# Altium project Ultrascale.PrjPcb (part 2 of 3)

## Sheet Sheet10.SchDoc
size A3
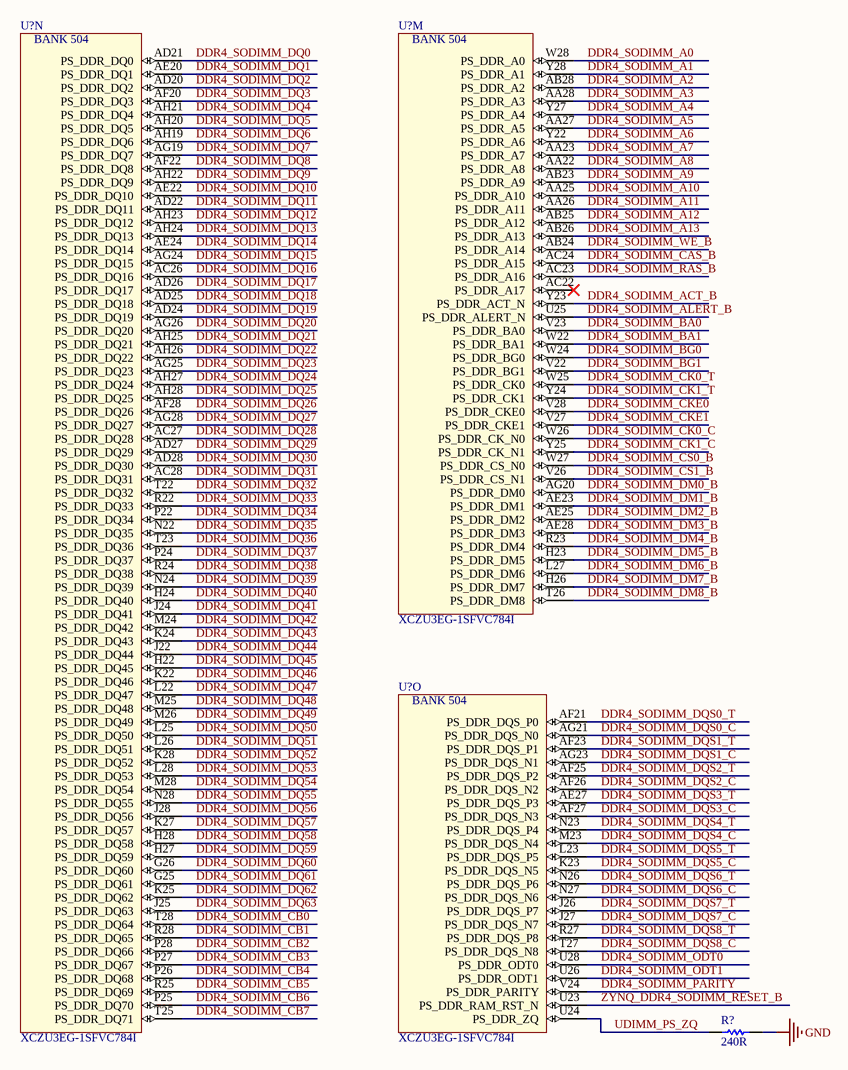
[diagram p5: Sheet10.SchDoc]

### Parts
(Parts that share a designator on the sheet are numbered #1, #2 ... from top to bottom, then left to right.)
R?#37  value 240R  [RESC1005L_0402]  (hidden comment: RES0402_240R_0W1_1T)
U?#29  XCZU3EG-1SFVC784I  [BGA784x28]  (part N of 22)
U?#30  XCZU3EG-1SFVC784I  [BGA784x28]  (part M of 22)
U?#31  XCZU3EG-1SFVC784I  [BGA784x28]  (part O of 22)

### Nets
GND: R?#37.1
DDR4_SODIMM_A0: U?#30.W28(PS_DDR_A0)
DDR4_SODIMM_A1: U?#30.Y28(PS_DDR_A1)
DDR4_SODIMM_A2: U?#30.AB28(PS_DDR_A2)
DDR4_SODIMM_A3: U?#30.AA28(PS_DDR_A3)
DDR4_SODIMM_A4: U?#30.Y27(PS_DDR_A4)
DDR4_SODIMM_A5: U?#30.AA27(PS_DDR_A5)
DDR4_SODIMM_A6: U?#30.Y22(PS_DDR_A6)
DDR4_SODIMM_A7: U?#30.AA23(PS_DDR_A7)
DDR4_SODIMM_A8: U?#30.AA22(PS_DDR_A8)
DDR4_SODIMM_A9: U?#30.AB23(PS_DDR_A9)
DDR4_SODIMM_A10: U?#30.AA25(PS_DDR_A10)
DDR4_SODIMM_A11: U?#30.AA26(PS_DDR_A11)
DDR4_SODIMM_A12: U?#30.AB25(PS_DDR_A12)
DDR4_SODIMM_A13: U?#30.AB26(PS_DDR_A13)
DDR4_SODIMM_ACT_B: U?#30.Y23(PS_DDR_ACT_N)
DDR4_SODIMM_ALERT_B: U?#30.U25(PS_DDR_ALERT_N)
DDR4_SODIMM_BA0: U?#30.V23(PS_DDR_BA0)
DDR4_SODIMM_BA1: U?#30.W22(PS_DDR_BA1)
DDR4_SODIMM_BG0: U?#30.W24(PS_DDR_BG0)
DDR4_SODIMM_BG1: U?#30.V22(PS_DDR_BG1)
DDR4_SODIMM_CAS_B: U?#30.AC24(PS_DDR_A15)
DDR4_SODIMM_CB0: U?#29.T28(PS_DDR_DQ64)
DDR4_SODIMM_CB1: U?#29.R28(PS_DDR_DQ65)
DDR4_SODIMM_CB2: U?#29.P28(PS_DDR_DQ66)
DDR4_SODIMM_CB3: U?#29.P27(PS_DDR_DQ67)
DDR4_SODIMM_CB4: U?#29.P26(PS_DDR_DQ68)
DDR4_SODIMM_CB5: U?#29.R25(PS_DDR_DQ69)
DDR4_SODIMM_CB6: U?#29.P25(PS_DDR_DQ70)
DDR4_SODIMM_CB7: U?#29.T25(PS_DDR_DQ71)
DDR4_SODIMM_CK0_C: U?#30.W26(PS_DDR_CK_N0)
DDR4_SODIMM_CK0_T: U?#30.W25(PS_DDR_CK0)
DDR4_SODIMM_CK1_C: U?#30.Y25(PS_DDR_CK_N1)
DDR4_SODIMM_CK1_T: U?#30.Y24(PS_DDR_CK1)
DDR4_SODIMM_CKE0: U?#30.V28(PS_DDR_CKE0)
DDR4_SODIMM_CKE1: U?#30.V27(PS_DDR_CKE1)
DDR4_SODIMM_CS0_B: U?#30.W27(PS_DDR_CS_N0)
DDR4_SODIMM_CS1_B: U?#30.V26(PS_DDR_CS_N1)
DDR4_SODIMM_DM0_B: U?#30.AG20(PS_DDR_DM0)
DDR4_SODIMM_DM1_B: U?#30.AE23(PS_DDR_DM1)
DDR4_SODIMM_DM2_B: U?#30.AE25(PS_DDR_DM2)
DDR4_SODIMM_DM3_B: U?#30.AE28(PS_DDR_DM3)
DDR4_SODIMM_DM4_B: U?#30.R23(PS_DDR_DM4)
DDR4_SODIMM_DM5_B: U?#30.H23(PS_DDR_DM5)
DDR4_SODIMM_DM6_B: U?#30.L27(PS_DDR_DM6)
DDR4_SODIMM_DM7_B: U?#30.H26(PS_DDR_DM7)
DDR4_SODIMM_DM8_B: U?#30.T26(PS_DDR_DM8)
DDR4_SODIMM_DQ0: U?#29.AD21(PS_DDR_DQ0)
DDR4_SODIMM_DQ1: U?#29.AE20(PS_DDR_DQ1)
DDR4_SODIMM_DQ2: U?#29.AD20(PS_DDR_DQ2)
DDR4_SODIMM_DQ3: U?#29.AF20(PS_DDR_DQ3)
DDR4_SODIMM_DQ4: U?#29.AH21(PS_DDR_DQ4)
DDR4_SODIMM_DQ5: U?#29.AH20(PS_DDR_DQ5)
DDR4_SODIMM_DQ6: U?#29.AH19(PS_DDR_DQ6)
DDR4_SODIMM_DQ7: U?#29.AG19(PS_DDR_DQ7)
DDR4_SODIMM_DQ8: U?#29.AF22(PS_DDR_DQ8)
DDR4_SODIMM_DQ9: U?#29.AH22(PS_DDR_DQ9)
DDR4_SODIMM_DQ10: U?#29.AE22(PS_DDR_DQ10)
DDR4_SODIMM_DQ11: U?#29.AD22(PS_DDR_DQ11)
DDR4_SODIMM_DQ12: U?#29.AH23(PS_DDR_DQ12)
DDR4_SODIMM_DQ13: U?#29.AH24(PS_DDR_DQ13)
DDR4_SODIMM_DQ14: U?#29.AE24(PS_DDR_DQ14)
DDR4_SODIMM_DQ15: U?#29.AG24(PS_DDR_DQ15)
DDR4_SODIMM_DQ16: U?#29.AC26(PS_DDR_DQ16)
DDR4_SODIMM_DQ17: U?#29.AD26(PS_DDR_DQ17)
DDR4_SODIMM_DQ18: U?#29.AD25(PS_DDR_DQ18)
DDR4_SODIMM_DQ19: U?#29.AD24(PS_DDR_DQ19)
DDR4_SODIMM_DQ20: U?#29.AG26(PS_DDR_DQ20)
DDR4_SODIMM_DQ21: U?#29.AH25(PS_DDR_DQ21)
DDR4_SODIMM_DQ22: U?#29.AH26(PS_DDR_DQ22)
DDR4_SODIMM_DQ23: U?#29.AG25(PS_DDR_DQ23)
DDR4_SODIMM_DQ24: U?#29.AH27(PS_DDR_DQ24)
DDR4_SODIMM_DQ25: U?#29.AH28(PS_DDR_DQ25)
DDR4_SODIMM_DQ26: U?#29.AF28(PS_DDR_DQ26)
DDR4_SODIMM_DQ27: U?#29.AG28(PS_DDR_DQ27)
DDR4_SODIMM_DQ28: U?#29.AC27(PS_DDR_DQ28)
DDR4_SODIMM_DQ29: U?#29.AD27(PS_DDR_DQ29)
DDR4_SODIMM_DQ30: U?#29.AD28(PS_DDR_DQ30)
DDR4_SODIMM_DQ31: U?#29.AC28(PS_DDR_DQ31)
DDR4_SODIMM_DQ32: U?#29.T22(PS_DDR_DQ32)
DDR4_SODIMM_DQ33: U?#29.R22(PS_DDR_DQ33)
DDR4_SODIMM_DQ34: U?#29.P22(PS_DDR_DQ34)
DDR4_SODIMM_DQ35: U?#29.N22(PS_DDR_DQ35)
DDR4_SODIMM_DQ36: U?#29.T23(PS_DDR_DQ36)
DDR4_SODIMM_DQ37: U?#29.P24(PS_DDR_DQ37)
DDR4_SODIMM_DQ38: U?#29.R24(PS_DDR_DQ38)
DDR4_SODIMM_DQ39: U?#29.N24(PS_DDR_DQ39)
DDR4_SODIMM_DQ40: U?#29.H24(PS_DDR_DQ40)
DDR4_SODIMM_DQ41: U?#29.J24(PS_DDR_DQ41)
DDR4_SODIMM_DQ42: U?#29.M24(PS_DDR_DQ42)
DDR4_SODIMM_DQ43: U?#29.K24(PS_DDR_DQ43)
DDR4_SODIMM_DQ44: U?#29.J22(PS_DDR_DQ44)
DDR4_SODIMM_DQ45: U?#29.H22(PS_DDR_DQ45)
DDR4_SODIMM_DQ46: U?#29.K22(PS_DDR_DQ46)
DDR4_SODIMM_DQ47: U?#29.L22(PS_DDR_DQ47)
DDR4_SODIMM_DQ48: U?#29.M25(PS_DDR_DQ48)
DDR4_SODIMM_DQ49: U?#29.M26(PS_DDR_DQ49)
DDR4_SODIMM_DQ50: U?#29.L25(PS_DDR_DQ50)
DDR4_SODIMM_DQ51: U?#29.L26(PS_DDR_DQ51)
DDR4_SODIMM_DQ52: U?#29.K28(PS_DDR_DQ52)
DDR4_SODIMM_DQ53: U?#29.L28(PS_DDR_DQ53)
DDR4_SODIMM_DQ54: U?#29.M28(PS_DDR_DQ54)
DDR4_SODIMM_DQ55: U?#29.N28(PS_DDR_DQ55)
DDR4_SODIMM_DQ56: U?#29.J28(PS_DDR_DQ56)
DDR4_SODIMM_DQ57: U?#29.K27(PS_DDR_DQ57)
DDR4_SODIMM_DQ58: U?#29.H28(PS_DDR_DQ58)
DDR4_SODIMM_DQ59: U?#29.H27(PS_DDR_DQ59)
DDR4_SODIMM_DQ60: U?#29.G26(PS_DDR_DQ60)
DDR4_SODIMM_DQ61: U?#29.G25(PS_DDR_DQ61)
DDR4_SODIMM_DQ62: U?#29.K25(PS_DDR_DQ62)
DDR4_SODIMM_DQ63: U?#29.J25(PS_DDR_DQ63)
DDR4_SODIMM_DQS0_C: U?#31.AG21(PS_DDR_DQS_N0)
DDR4_SODIMM_DQS0_T: U?#31.AF21(PS_DDR_DQS_P0)
DDR4_SODIMM_DQS1_C: U?#31.AG23(PS_DDR_DQS_N1)
DDR4_SODIMM_DQS1_T: U?#31.AF23(PS_DDR_DQS_P1)
DDR4_SODIMM_DQS2_C: U?#31.AF26(PS_DDR_DQS_N2)
DDR4_SODIMM_DQS2_T: U?#31.AF25(PS_DDR_DQS_P2)
DDR4_SODIMM_DQS3_C: U?#31.AF27(PS_DDR_DQS_N3)
DDR4_SODIMM_DQS3_T: U?#31.AE27(PS_DDR_DQS_P3)
DDR4_SODIMM_DQS4_C: U?#31.M23(PS_DDR_DQS_N4)
DDR4_SODIMM_DQS4_T: U?#31.N23(PS_DDR_DQS_P4)
DDR4_SODIMM_DQS5_C: U?#31.K23(PS_DDR_DQS_N5)
DDR4_SODIMM_DQS5_T: U?#31.L23(PS_DDR_DQS_P5)
DDR4_SODIMM_DQS6_C: U?#31.N27(PS_DDR_DQS_N6)
DDR4_SODIMM_DQS6_T: U?#31.N26(PS_DDR_DQS_P6)
DDR4_SODIMM_DQS7_C: U?#31.J27(PS_DDR_DQS_N7)
DDR4_SODIMM_DQS7_T: U?#31.J26(PS_DDR_DQS_P7)
DDR4_SODIMM_DQS8_C: U?#31.T27(PS_DDR_DQS_N8)
DDR4_SODIMM_DQS8_T: U?#31.R27(PS_DDR_DQS_P8)
DDR4_SODIMM_ODT0: U?#31.U28(PS_DDR_ODT0)
DDR4_SODIMM_ODT1: U?#31.U26(PS_DDR_ODT1)
DDR4_SODIMM_PARITY: U?#31.V24(PS_DDR_PARITY)
DDR4_SODIMM_RAS_B: U?#30.AC23(PS_DDR_A16)
DDR4_SODIMM_WE_B: U?#30.AB24(PS_DDR_A14)
UDIMM_PS_ZQ: R?#37.2 U?#31.U24(PS_DDR_ZQ)
ZYNQ_DDR4_SODIMM_RESET_B: U?#31.U23(PS_DDR_RAM_RST_N)

Not connected (* = marked no-connect by the designer): U?#30 AC22(PS_DDR_A17)*

### Notes on the sheet
- (in symbol XCZU3EG-1SFVC784I, part M) BANK 504
- (in symbol XCZU3EG-1SFVC784I, part N) BANK 504
- (in symbol XCZU3EG-1SFVC784I, part O) BANK 504

### Library data of the parts
R?#37 = RES0402_240R_0W1_1T: RES SMD 240 OHM 1% 1/10W 0402; Manufacturer 1: Panasonic Electronic Components; Manufacturer Part Number 1: ERJ-2RKF2400X; Package: 0402; ComponentLink1Description: Datasheet; Power: 1/10W; Tolerance: 1%; Supplier 1: Digi-Key; Supplier Part Number 1: P240LCT-ND
U?#29-U?#31 = XCZU3EG-1SFVC784I: IC FPGA 252 I/O 784FCBGA - XILINX ZYNQ ULTRASCALE+; Manufacturer 1: Xilinx Inc.; Package: SFVC784; ComponentLink1Description: Datasheet; Supplier 1: Digi-Key; Supplier Part Number 1: XCZU3EG-1SFVC784I-ND; Manufacturer Part Number 1: XCZU3EG-1SFVC784I

## Sheet Sheet11.SchDoc
size A3
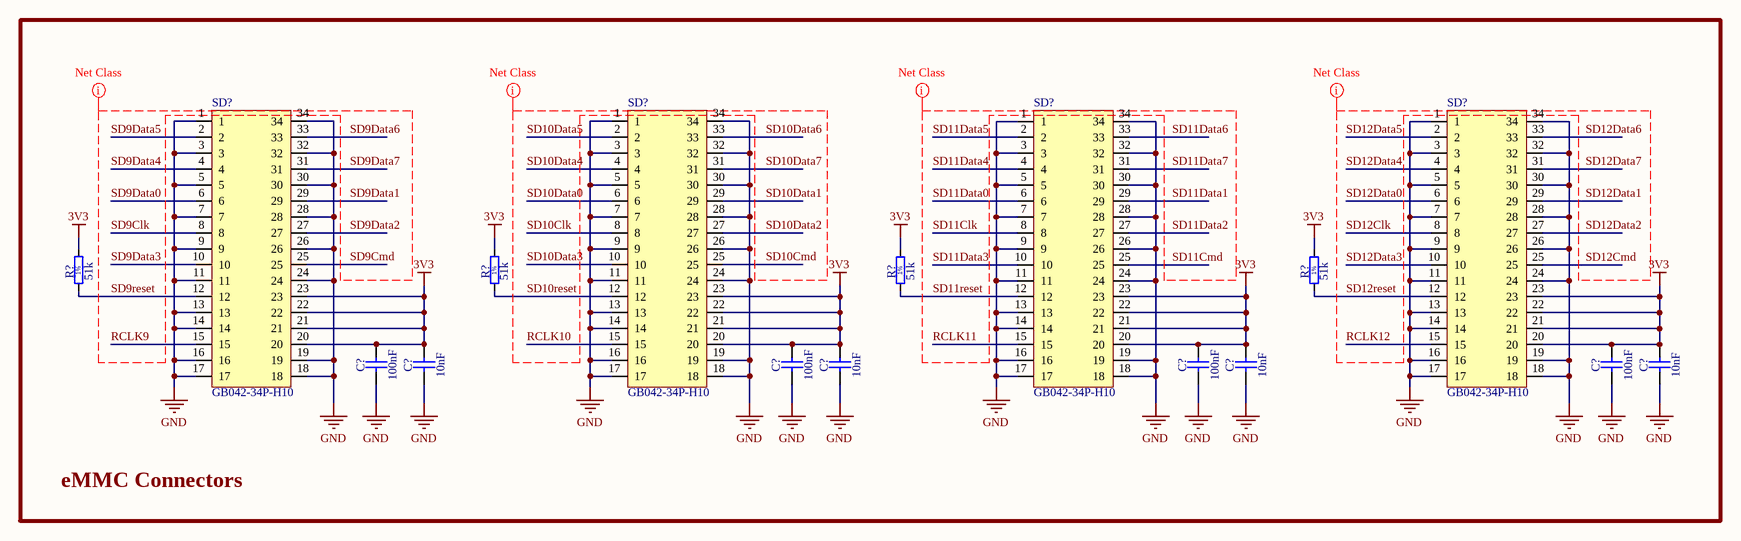
[diagram p6: Sheet11.SchDoc]

### Parts
(Parts that share a designator on the sheet are numbered #1, #2 ... from top to bottom, then left to right.)
C?#116  100nF  [CAPC1608X87N]
C?#117  10nF  [CAPC1608X87N]
C?#118  100nF  [CAPC1608X87N]
C?#119  10nF  [CAPC1608X87N]
C?#120  100nF  [CAPC1608X87N]
C?#121  10nF  [CAPC1608X87N]
C?#122  100nF  [CAPC1608X87N]
C?#123  10nF  [CAPC1608X87N]
R?#38  51k  [RESC1608X55N]
R?#39  51k  [RESC1608X55N]
R?#40  51k  [RESC1608X55N]
R?#41  51k  [RESC1608X55N]
SD?#1  GB042-34P-H10  [GB042-34P-H10]
SD?#2  GB042-34P-H10  [GB042-34P-H10]
SD?#3  GB042-34P-H10  [GB042-34P-H10]
SD?#4  GB042-34P-H10  [GB042-34P-H10]

### Blocks framed on the sheet
eMMC Connectors: C?#116-C?#123 R?#38-R?#41 SD?#1-SD?#4

### Nets
3V3: C?#116.2 C?#117.2 C?#118.2 C?#119.2 C?#120.2 C?#121.2 C?#122.2 C?#123.2 R?#38.2 R?#39.2 R?#40.2 R?#41.2 SD?#1.20 SD?#1.21 SD?#1.22 SD?#1.23 SD?#2.20 SD?#2.21 SD?#2.22 SD?#2.23 SD?#3.20 SD?#3.21 SD?#3.22 SD?#3.23 SD?#4.20 SD?#4.21 SD?#4.22 SD?#4.23
GND: C?#116.1 C?#117.1 C?#118.1 C?#119.1 C?#120.1 C?#121.1 C?#122.1 C?#123.1 SD?#1.1 SD?#1.3 SD?#1.5 SD?#1.7 SD?#1.9 SD?#1.11 SD?#1.13 SD?#1.14 SD?#1.16 SD?#1.17 SD?#1.18 SD?#1.19 SD?#1.24 SD?#1.26 SD?#1.28 SD?#1.30 SD?#1.32 SD?#1.34 SD?#2.1 SD?#2.3 SD?#2.5 SD?#2.7 SD?#2.9 SD?#2.11 SD?#2.13 SD?#2.14 SD?#2.16 SD?#2.17 SD?#2.18 SD?#2.19 SD?#2.24 SD?#2.26 SD?#2.28 SD?#2.30 SD?#2.32 SD?#2.34 SD?#3.1 SD?#3.3 SD?#3.5 SD?#3.7 SD?#3.9 SD?#3.11 SD?#3.13 SD?#3.14 SD?#3.16 SD?#3.17 SD?#3.18 SD?#3.19 SD?#3.24 SD?#3.26 SD?#3.28 SD?#3.30 SD?#3.32 SD?#3.34 SD?#4.1 SD?#4.3 SD?#4.5 SD?#4.7 SD?#4.9 SD?#4.11 SD?#4.13 SD?#4.14 SD?#4.16 SD?#4.17 SD?#4.18 SD?#4.19 SD?#4.24 SD?#4.26 SD?#4.28 SD?#4.30 SD?#4.32 SD?#4.34
RCLK9: SD?#1.15
RCLK10: SD?#2.15
RCLK11: SD?#3.15
RCLK12: SD?#4.15
SD9Clk: SD?#1.8
SD9Cmd: SD?#1.25
SD9Data0: SD?#1.6
SD9Data1: SD?#1.29
SD9Data2: SD?#1.27
SD9Data3: SD?#1.10
SD9Data4: SD?#1.4
SD9Data5: SD?#1.2
SD9Data6: SD?#1.33
SD9Data7: SD?#1.31
SD9reset: R?#38.1 SD?#1.12
SD10Clk: SD?#2.8
SD10Cmd: SD?#2.25
SD10Data0: SD?#2.6
SD10Data1: SD?#2.29
SD10Data2: SD?#2.27
SD10Data3: SD?#2.10
SD10Data4: SD?#2.4
SD10Data5: SD?#2.2
SD10Data6: SD?#2.33
SD10Data7: SD?#2.31
SD10reset: R?#39.1 SD?#2.12
SD11Clk: SD?#3.8
SD11Cmd: SD?#3.25
SD11Data0: SD?#3.6
SD11Data1: SD?#3.29
SD11Data2: SD?#3.27
SD11Data3: SD?#3.10
SD11Data4: SD?#3.4
SD11Data5: SD?#3.2
SD11Data6: SD?#3.33
SD11Data7: SD?#3.31
SD11reset: R?#40.1 SD?#3.12
SD12Clk: SD?#4.8
SD12Cmd: SD?#4.25
SD12Data0: SD?#4.6
SD12Data1: SD?#4.29
SD12Data2: SD?#4.27
SD12Data3: SD?#4.10
SD12Data4: SD?#4.4
SD12Data5: SD?#4.2
SD12Data6: SD?#4.33
SD12Data7: SD?#4.31
SD12reset: R?#41.1 SD?#4.12

### Layout directives
net class SD9: RCLK9, SD9Clk, SD9Cmd, SD9Data0, SD9Data1, SD9Data2, SD9Data3, SD9Data4, SD9Data5, SD9Data6, SD9Data7, SD9reset
net class SD10: RCLK10, SD10Clk, SD10Cmd, SD10Data0, SD10Data1, SD10Data2, SD10Data3, SD10Data4, SD10Data5, SD10Data6, SD10Data7, SD10reset
net class SD11: RCLK11, SD11Clk, SD11Cmd, SD11Data0, SD11Data1, SD11Data2, SD11Data3, SD11Data4, SD11Data5, SD11Data6, SD11Data7, SD11reset
net class SD12: RCLK12, SD12Clk, SD12Cmd, SD12Data0, SD12Data1, SD12Data2, SD12Data3, SD12Data4, SD12Data5, SD12Data6, SD12Data7, SD12reset

### Notes on the sheet
- (in symbol R0603_51K_1%_0.1W_100PPM) 1%

### Library data of the parts
C?#116 C?#118 C?#120 C?#122 = CC0603_100NF_50V_10%_X7R: Non-polarised capacitor; Part Description: SMD Multilayer Chip Ceramic Capacitor; Manufacturer: MULTICOMP; Manufacturer Part Number: MCB0603R104KCT; Manufacturer1 Part Number: 223858615649; Voltage: 50V; TC: X7R; Tolerance: ±10%; Table: Capacitors SMD; Voltage Rating: 16; Capacitance: 0.1; SVHC: No SVHC (17-Dec-2015); Ceramic Capacitor Case: 0603 [1608 Metric]; Dielectric Characteristic: X7; Product Range: MCB Series; Capacitance Tolerance: ± 10%; Capacitor Terminals: SMD; Part Number: CC0603_100NF_50V_10%_X7R; Component Kind: Standard; Component Type: Standard; Pin Count: 2; Value: 100nF; Status: Preferred; Case: 0603; Mounted: Yes; Socket: No; SMD: Yes; Manufacturer1 Example: PHYCOMP; Manufacturer1 ComponentHeight: 0.87mm; HelpURL: \\cern.ch\dfs\Applications\Altium\Datasheets\CC0603_X7R_PHYCOMP.pdf; Author: CERN DEM JLC; CreateDate: 3.12.2007; LatestRevisionDate: 3.12.2007; RoHS: YES; Packaging: Cut Tape; Operating Temperature Min: -55; MSL: -; Supplier Part Number: 9406140; Operating Temperature Range: -55°C to +125°C<!--FANDB--><div class="features-and-benefits-container"><div class="features-and-benefits-description"><span class="features-benefits-value">The MCB0603R104KCT is a multilayer Ceramic Capacitor with 0603 chip, for general digital circuit. Consists of a conducting material and electrodes. To manufacture a chip-type SMT and achieve miniaturization, high density and high efficiency, ceramic condensers are used. MLCC is made by X7; Supplier: Farnell; Capacitance Tolerance ±: ± 10%; Operating Temperature Max: 125
C?#117 C?#119 C?#121 C?#123 = CC0603_10NF_50V_10%_X7R: Non-polarised capacitor; Part Description: SMD Multilayer Chip Ceramic Capacitor; Manufacturer: MULTICOMP; Manufacturer Part Number: MC0603B103K500CT; Manufacturer1 Part Number: 223858615636; Voltage: 50V; TC: X7R; Tolerance: ±10%; Table: Capacitors SMD; Voltage Rating: 50; Product Range: MC Series; No. of Pins: 2; Capacitor Terminals: SMD; Ceramic Capacitor Case: 0603 [1608 Metric]; SVHC: No SVHC (17-Dec-2015); Capacitance Tolerance ±: ± 10%; External Length / Height: 0.8; Dielectric Characteristic: X7; External Depth: 1.6; Capacitance: 0.01; Part Number: CC0603_10NF_50V_10%_X7R; Component Kind: Standard; Component Type: Standard; Pin Count: 2; Value: 10nF; Status: Preferred; Case: 0603; Mounted: Yes; Socket: No; SMD: Yes; Manufacturer1 Example: PHYCOMP; Manufacturer1 ComponentHeight: 0.87mm; HelpURL: \\cern.ch\dfs\Applications\Altium\Datasheets\CC0603_X7R_PHYCOMP.pdf; Author: CERN DEM JLC; CreateDate: 3.12.2007; LatestRevisionDate: 3.12.2007; Operating Temperature Range: -55°C to +125°C<!--FANDB--><div class="features-and-benefits-container"><div class="features-and-benefits-description"><span class="features-benefits-value">The Multicomp MC series is general purpose MLCC capacitors with X7R dielectric material which provides high electrical precision, stability and reliability. This MLCC capacitor consists of a conducting material and electrodes with high density and high efficiency ceramic condensers.</span></div><div class="features-and-benefits-list"><ul class="features-and-benefits-list-list"><li class="features-and-benefits-list-item">Small size with higher capacitance values</li><li class="features-and-benefits-list-item">0201, 0402, 0603, 0805, 1206, 1210, 1812 case sizes available</li><li class="features-and-benefits-list-item">Capacitance value ranging from 100pF to 47?F</li><li class="features-and-benefits-list-item">Capacitor with lead free termination (pure Tin)</li><li class="features-and-benefits-list-item">High electrical precision, stability and reliability</li><li class="features-and-benefits-list-item">Rated voltage of 6.3V, 10V, 16V, 25V, 50V, 100V</li><li class="features-and-benefits-list-item">Operating temperature of -55°C to +125°C</li><li class="features-and-benefits-list-item">Available in ±5%, ±10% and ±20; MSL: -; Supplier: Farnell; Capacitance Tolerance: ± 10%; External Width: 0.8; Supplier Part Number: 1759102; Packaging: Cut Tape; Operating Temperature Max: 125; Operating Temperature Min: -55; RoHS: YES
R?#38-R?#41 = R0603_51K_1%_0.1W_100PPM: Resistor - 1%; Part Description: General Purpose Thick Film Chip Resistor; Manufacturer: Yageo; Manufacturer Part Number: RC0603JR-0751KL; Manufacturer1 Part Number: NRC06F5102TRF; Power: 0.1W; TC: ±100ppm/°C; Tolerance: ±5%; Table: Resistors SMD; Power (Watts): 0.1W, 1/10W; Part Number: R0603_51K_1%_0.1W_100PPM; Component Kind: Standard; Component Type: Standard; Pin Count: 2; Value: 51k; Status: Preferred; Case: 0603; Mounted: Yes; Socket: No; SMD: Yes; Manufacturer1 Example: NIC COMPONENT; Manufacturer1 ComponentHeight: 0.55mm; HelpURL: \\cern.ch\dfs\Applications\Altium\Datasheets\R0603_NIC_NRC.pdf; Author: CERN DEM JLC; CreateDate: 3.12.2007; LatestRevisionDate: 13.03.2008; Height: 0.022" (0.55mm); Features: Moisture Resistant; RoHS: RoHS Compliant; Number of Terminations: 2; Category: Resistors; Composition: Thick Film; Resistance (Ohms): 51k; Size / Dimension: 0.063" L x 0.031" W (1.60mm x 0.80mm); Supplier Part Number: 311-51KGRCT-ND; Supplier Device Package: 0603; Package / Case: 0603 (1608 Metric); Supplier: Digi-Key; Temperature Coefficient: ±100ppm/°C; Packaging: Cut Tape (CT); Operating Temperature: -55°C ~ 155°C
SD?#1-SD?#4 = GB042-34P-H10: Connector, eMMC